# EAGLE design CY7C65211 Breakout (EAGLE 6.4)
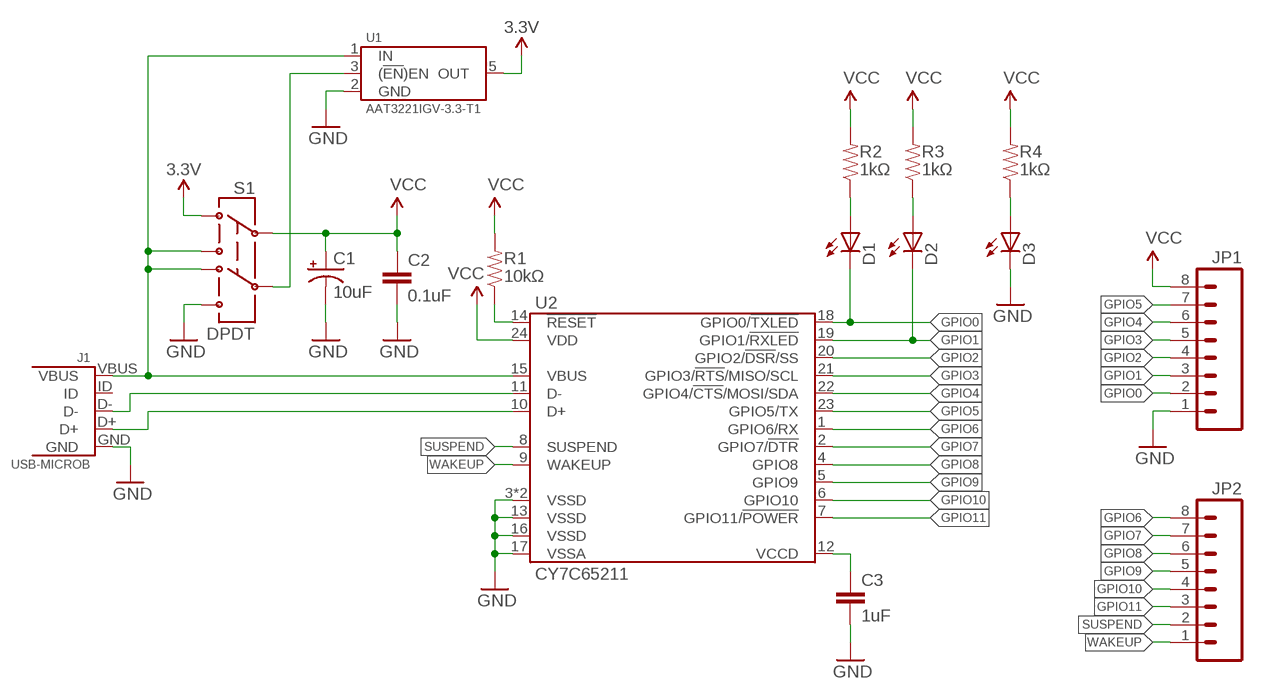
[diagram p0: schematic, sheet 1]

## Parts
C1  10uF  CAP_POL0805  [0805-CAP_POL]
C2  0.1uF  CAP-0402  [0402-CAP]
C3  1uF  CAP-0402  [0402-CAP]
D1  LED0603  [LED-0603]
D2  LED0603  [LED-0603]
D3  LED0603  [LED-0603]
J1  USB-MICROB  [USB-MICROB]
JP1  M081X08  [1X08]
JP2  M081X08  [1X08]
R1  10kΩ  RESISTOR  [0402-RES]
R2  1kΩ  RESISTOR  [0402-RES]
R3  1kΩ  RESISTOR  [0402-RES]
R4  1kΩ  RESISTOR  [0402-RES]
S1  DPDT  SWITCH-DPDTAYZ0202  [AYZ0202]
U1  AAT3221IGV-3.3-T1  [SOT23-5]
U2  CY7C65211  [QFN-24]

## Nets
3.3V: S1.1 U1.5(OUT)
GND: C1.C(-) C2.2 C3.2 D3.C J1.GND JP1.1 S1.6 U1.2(GND) U2.3(VSSD) U2.13(VSSD) U2.16(VSSD) U2.17(VSSA) U2.EP(VSSD)
GPIO0: D1.C JP1.2 U2.18(GPIO0/!TXLED)
GPIO1: D2.C JP1.3 U2.19(GPIO1/!RXLED)
GPIO2: JP1.4 U2.20(GPIO2/!DSR!/SS)
GPIO3: JP1.5 U2.21(GPIO3/!RTS!/MISO/SCL)
GPIO4: JP1.6 U2.22(GPIO4/!CTS!/MOSI/SDA)
GPIO5: JP1.7 U2.23(GPIO5/TX)
GPIO6: JP2.8 U2.1(GPIO6/RX)
GPIO7: JP2.7 U2.2(GPIO7/!DTR)
GPIO8: JP2.6 U2.4(GPIO8)
GPIO9: JP2.5 U2.5(GPIO9)
GPIO10: JP2.4 U2.6(GPIO10)
GPIO11: JP2.3 U2.7(GPIO11/!POWER)
N$1: J1.VBUS S1.3 S1.4 U1.1(IN) U2.15(VBUS)
N$2: J1.D- U2.11(D-)
N$3: J1.D+ U2.10(D+)
N$4: S1.5 U1.3((!EN!)EN)
N$5: D2.A R3.1
N$6: R1.1 U2.14(!RESET)
N$7: C3.1 U2.12(VCCD)
N$8: D1.A R2.1
N$9: D3.A R4.1
SUSPEND: JP2.2 U2.8(SUSPEND)
VCC: C1.A(+) C2.1 JP1.8 R1.2 R2.2 R3.2 R4.2 S1.2 U2.24(VDD)
WAKEUP: JP2.1 U2.9(WAKEUP)
Unconnected: J1.ID

## Library data of the parts
C1 = SparkFun-Passives:CAP_POL: Capacitor Polarized These are standard SMD and PTH capacitors. Normally 10uF, 47uF, and 100uF in electrolytic and tantalum varieties. Always verify the external diameter of the through hole cap, it varies with capacity, voltage, and manufacturer. The EIA devices should be standard.
C2 C3 = Passives:CAP
D1-D3 = SparkFun-LED:LED: LEDs Standard schematic elements and footprints for 5mm, 3mm, 1206, and 0603 sized LEDs. 5mm - Spark Fun Electronics SKU : COM-00529 (and others)
J1 = Connectors:USB-MICROB
JP1 JP2 = SparkFun-Connectors:M08: Header 8 Standard 8-pin 0.1" header. Use with straight break away headers (SKU : PRT-00116), right angle break away headers (PRT-00553), swiss pins (PRT-00743), machine pins (PRT-00117), and female headers (PRT-00115).
R1-R4 = Passives:RESISTOR
S1 = SparkFun-Electromechanical:SWITCH-DPDT: DPDT Version of the COM-00597; PROD_ID: SWCH-08179
U1 = Skyworks:AAT3221: 150mA 3.3v LDO Regulator
U2 = Cypress:CY7C65211

## Board
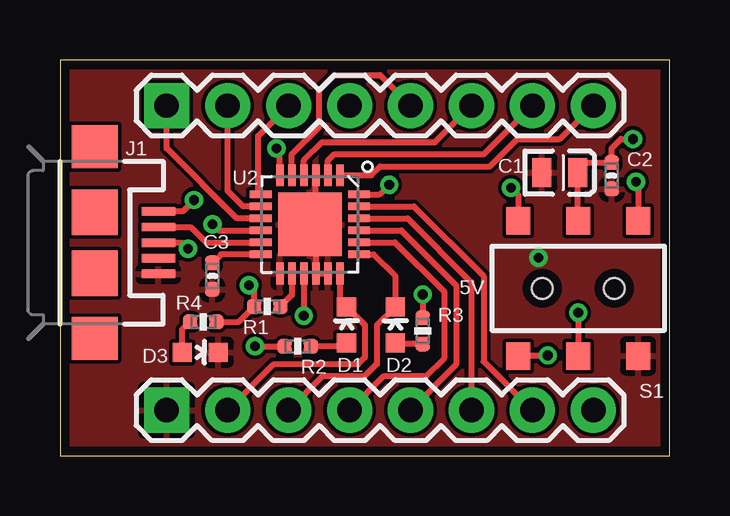
[diagram p1: board, top side]
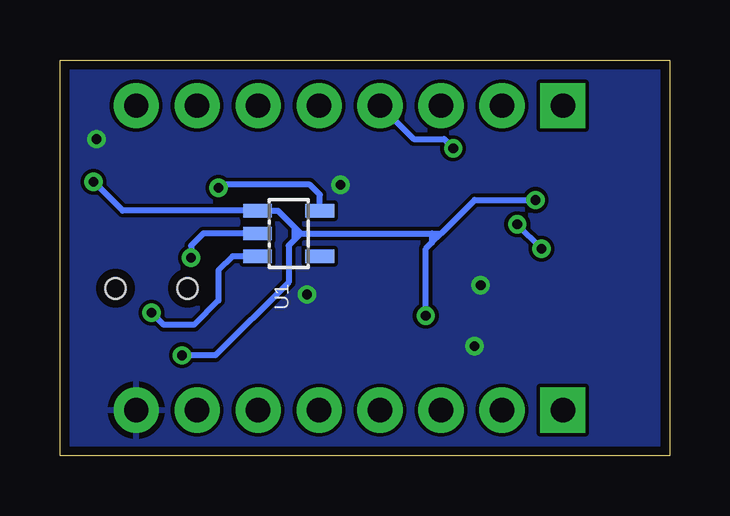
[diagram p2: board, bottom side, seen from below]

Size 25.4 x 16.51 mm. Coordinates in mm from the lower left corner, seen from the top.
Outline: 0,0 25.4,0 25.4,16.51 0,16.51 0,0
Copper layers (1*16): Top 0.0356mm / dielectric 1.5011mm / Bottom 0.0356mm
Design rules "LaenPCBOrder *": minimum track width 6mil, minimum drill 13mil, track to track 6mil, track to pad 6mil, pad to pad 6mil, via to via 6mil, smd to smd 6mil, copper to edge 15mil, drill to drill 6mil, minimum pad ring 7mil, minimum via ring 7mil, stop-mask expansion 4mil, vias tented up to drill 17mil, thermal gap 10mil

### Footprints (pad centres in the part's own frame; a part is rotated, then mirrored left to right if it is on the bottom)
0805-CAP_POL = smd 0.8 x 1.2: A 0.75,0; C -0.75,0
0402-CAP = smd 0.6 x 0.6: 1 -0.55,0; 2 0.55,0
LED-0603 = smd 0.8 x 0.8: A 0,-0.75; C 0,0.75
USB-MICROB = smd 0.35 x 1.4: D+ 0,2.65; D- -0.65,2.65; GND 1.3,2.65; ID 0.65,2.65; VBUS -1.3,2.65 | smd 1.8 x 1.9: MT1 -4,0; MT2 4,0 | smd 1.9 x 1.9: P$1 -1.27,0; P$2 1.27,0
1X08 = drill 1.016 pad 1.88 square: 1 0,0 | drill 1.016 pad 1.88: 2 2.54,0; 3 5.08,0; 4 7.62,0; 5 10.16,0; 6 12.7,0; 7 15.24,0; 8 17.78,0
0402-RES = smd 0.6 x 0.6: 1 -0.55,0; 2 0.55,0
AYZ0202 = smd 1 x 1.15: 1 -2.5,2.825; 2 0,2.825; 3 2.5,2.825; 4 -2.5,-2.825; 5 0,-2.825; 6 2.5,-2.825 | hole 0.85: 1.5,0; -1.5,0
SOT23-5 = smd 1.2 x 0.55: 1 1.3,-0.95; 2 1.3,0; 3 1.3,0.95; 4 -1.3,0.95; 5 -1.3,-0.95
QFN-24 = smd 0.9 x 0.3: 1 -2.05,1.25; 2 -2.05,0.75; 3 -2.05,0.25; 4 -2.05,-0.25; 5 -2.05,-0.75; 6 -2.05,-1.25; 13 2.05,-1.25; 14 2.05,-0.75; 15 2.05,-0.25; 16 2.05,0.25; 17 2.05,0.75; 18 2.05,1.25 | smd 0.3 x 0.9: 7 -1.25,-2.05; 8 -0.75,-2.05; 9 -0.25,-2.05; 10 0.25,-2.05; 11 0.75,-2.05; 12 1.25,-2.05; 19 1.25,2.05; 20 0.75,2.05; 21 0.25,2.05; 22 -0.25,2.05; 23 -0.75,2.05; 24 -1.25,2.05 | smd 2.65 x 2.65: EP 0,0

### Placement (x,y rotation side)
C1  20.83,11.81 0 top
C2  22.99,11.68 270 top
C3  6.35,7.49 270 top
D1  11.94,5.46 0 top
D2  13.97,5.46 0 top
D3  5.84,4.32 270 top
J1  1.45,8.89 270 top
JP1  4.45,1.91 0 top
JP2  4.45,14.61 0 top
R1  8.64,6.22 180 top
R2  9.91,4.57 180 top
R3  15.11,5.21 90 top
R4  5.97,5.59 0 top
S1  21.59,6.99 0 top
U1  15.88,9.27 180 bottom
U2  10.41,9.65 270 top

### Tracks (layer width: path | path; a pad name or v marks a point on that pad's centre or on a via)
3.3V  (via drill 0.41)
  Top 0.254: v18.8,11.18 19.09,10.88 S1.1
  Bottom 0.254: U1.5 14.57,10.89 14.99,11.3 18.67,11.3 v18.8,11.18
GND  (via drill 0.41)
  Top 0.254: 10.66,9.65 U2.3 | U2.EP 10.66,9.65 | 10.66,9.65 U2.16 U2.17
  Bottom 0.254: U1.2 19.43,9.27 19.94,8.76 v19.94,8.26
  pour Top: -1.27,-1.27 26.67,-1.27 26.67,17.78 -1.27,17.78
GPIO0
  Top 0.254: U2.18 11.66,6.23 D1.C 12.7,5.45 12.7,4.09 12.42,3.81 8.89,3.81 JP1.2
GPIO1
  Top 0.254: U2.19 13.06,8.4 13.97,7.49 D2.C 13.21,5.45 13.21,3.83 12.68,3.3 10.92,3.3 JP1.3
GPIO2
  Top 0.254: U2.20 13.96,8.9 16,6.86 16,4.06 15.24,3.3 13.46,3.3 JP1.4
GPIO3
  Top 0.254: U2.21 14.22,9.4 16.51,7.11 16.51,3.81 JP1.5
GPIO4
  Top 0.254: U2.22 14.48,9.9 17.14,7.24 JP1.6
GPIO5
  Top 0.254: U2.23 14.74,10.4 17.65,7.49 17.65,3.94 JP1.7
GPIO6
  Top 0.254: U2.1 12.97,11.7 13.34,12.06 17.91,12.06 19.05,13.21 20.83,13.21 JP2.8
GPIO7
  Top 0.254: U2.2 11.16,12.31 11.43,12.57 17.65,12.57 JP2.7
GPIO8
  Top 0.254: U2.4 10.16,12.32 10.92,13.08 15.62,13.08 JP2.6
GPIO9
  Top 0.254: U2.5 9.66,12.59 10.79,13.72 10.79,15.24 11.43,15.88 13.34,15.88 JP2.5
GPIO10  (via drill 0.41)
  Top 0.254: U2.6 9.16,12.68 v9.02,12.83
  Bottom 0.254: JP2.4 10.67,13.21 9.4,13.21 v9.02,12.83
GPIO11
  Top 0.254: JP2.3 8.26,13.34 8.26,10.9 U2.7
N$1  (via drill 0.41)
  Top 0.254: U2.15 10.16,6.35 v10.16,5.84 | v5.59,10.67 5.11,10.19 J1.VBUS | v24,11.43 24.09,11.34 S1.3 | v20.32,4.19 20.29,4.16 S1.4
  Bottom 0.254: v10.16,5.84 10.16,8.64 9.91,8.89 | v5.59,10.67 8.13,10.67 9.53,9.27 | 9.91,8.89 9.53,9.27 | v24,11.43 22.79,10.22 U1.1 16.32,10.22 15.62,9.53 | 15.62,9.53 15.37,9.27 | 15.37,9.27 9.91,9.27 | 9.91,9.27 9.53,9.27 | 9.91,9.27 9.91,8.89 | 15.37,9.27 15.62,9.02 | 15.62,9.02 15.88,8.76 15.88,7.24 18.92,4.19 v20.32,4.19 | 15.62,9.02 15.62,9.53
N$2
  Top 0.254: J1.D- 5.45,9.54 6.08,8.9 U2.11
N$3  (via drill 0.41)
  Top 0.254: J1.D+ 5.08,8.89 v5.33,8.64 | v6.35,9.65 6.6,9.4 U2.10
  Bottom 0.254: v5.33,8.64 v6.35,9.65
N$4  (via drill 0.41)
  Top 0.254: v21.59,5.97 S1.5
  Bottom 0.254: U1.3 18.22,8.32 18.8,7.75 18.8,6.48 19.81,5.46 21.08,5.46 v21.59,5.97
N$5
  Top 0.254: R3.1 14.02,4.66 D2.A
N$6
  Top 0.254: U2.14 9.66,6.7 R1.1
N$7
  Top 0.254: U2.12 6.71,8.4 C3.1
N$8
  Top 0.254: D1.A 11.8,4.57 R2.1
N$9
  Top 0.254: D3.A 5.09,5.26 R4.1
N$23
  cutout Top: 11.56,10.16 11.43,10.16 11.43,9.14 11.56,9.14
SUSPEND
  Top 0.254: U2.8 7.63,10.4 6.99,11.05 JP2.2
VCC  (via drill 0.41)
  Top 0.254: U2.24 13.31,10.9 v13.72,11.3 | v7.87,7.11 8.09,6.9 R1.2 7.45,5.59 R4.2 | v15.11,6.73 R3.2 | v8.13,4.57 R2.2 | S1.2 21.58,9.82 C1.A 21.58,12.23 C2.1 22.99,12.83 23.37,13.21 v23.88,13.21
  pour Bottom: -2.54,-2.54 27.94,-2.54 27.94,19.05 -2.54,19.05
WAKEUP
  Top 0.254: U2.9 7.37,9.9 4.45,12.83 JP2.1

### Text on the board
tPlace: 5V
tDocu: WKUP | SPND | GPIO11 | GPIO10 | GPIO9 | GPIO8 | GPIO7 | GPIO6 | VCC | GPIO0 | GPIO1 | GPIO2 | GPIO3 | GPIO4 | GPIO5 | GND